# EAGLE design relayv2 (EAGLE 5.06)
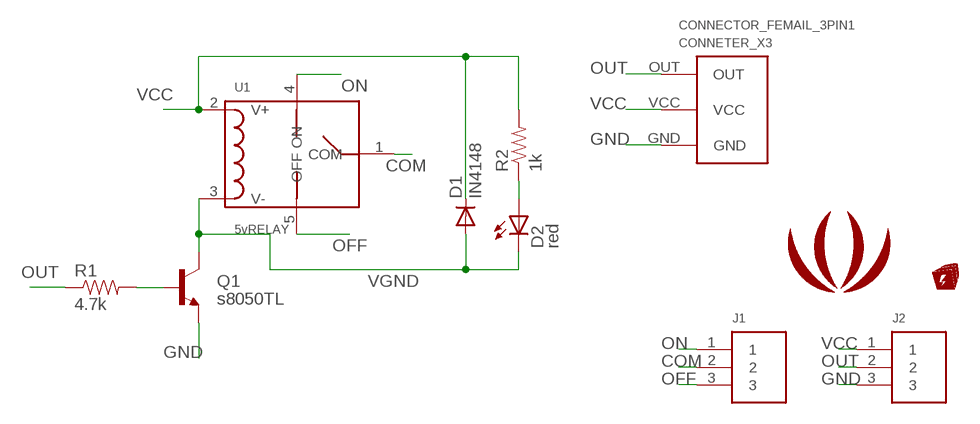
[diagram p0: schematic, sheet 1]

## Parts
CONNECTOR_FEMAIL_3PIN1  CONNETER_X3  [CONNETER_X3]
D1  IN4148  DIODE1N4148  [DIODE-1N4148]
D2  red  LED3MM  [LED3MM]
J1  3PIN_TERMINAL  [3PIN_TERMINAL]
J2  3PIN_TERMINAL  [3PIN_TERMINAL]
LOGO1  LOGO_COPPER150X124  [LOGO_COPPER_150X124]
Q1  s8050TL  TRANSISTOR_NPNTO92  [TO-92]
R1  4.7k  RESISTORPTH1  [AXIAL-0.3]
R2  1k  RESISTORPTH1  [AXIAL-0.3]
U1  5vRELAY  RELAY  [RELAY]
U$1  EB_150  [EB_150]

## Nets
COM: J1.2 U1.1(COM)
GND: CONNECTOR_FEMAIL_3PIN1.GND J2.3 Q1.1(E)
N$2: Q1.2(B) R1.P$2
N$4: D2.A R2.P$1
OFF: J1.3 U1.5(OFF)
ON: J1.1 U1.4(ON)
OUT: CONNECTOR_FEMAIL_3PIN1.OUT J2.2 R1.P$1
VCC: CONNECTOR_FEMAIL_3PIN1.VCC D1.C J2.1 R2.P$2 U1.2(V+)
VGND: D1.A D2.K(C) Q1.3(C) U1.3(V-)

## Library data of the parts
CONNECTOR_FEMAIL_3PIN1 = AnlogDevice:CONNETER_X3
D1 = SparkFun2:DIODE: Diode These are standard reverse protection diodes and small signal diodes. SMA package can handle up to about 1A. SOD-323 can handle about 200mA. What the SOD-323 package when ordering, there are some mfgs out there that are 5-pin packages.
D2 = SparkFun2:LED: LEDs Standard schematic elements and footprints for 5mm, 3mm, 1206, and 0603 sized LEDs. 5mm - Spark Fun Electronics SKU : COM-00529 (and others)
J1 J2 = Seeed:3PIN_TERMINAL
LOGO1 = logo:LOGO_COPPER
Q1 = SparkFun2:TRANSISTOR_NPN: Transistor NPN BJT configuration in SOT23 package. MMBT2222 is the common NPN we use. Double check BCE configuration again layout.
R1 R2 = SparkFun2:RESISTOR: Resistor Basic schematic elements and footprints for 0603, 1206, and PTH 1/10th watt (small) resistors.
U1 = Seeed:RELAY
U$1 = logo:EB_150

## Board
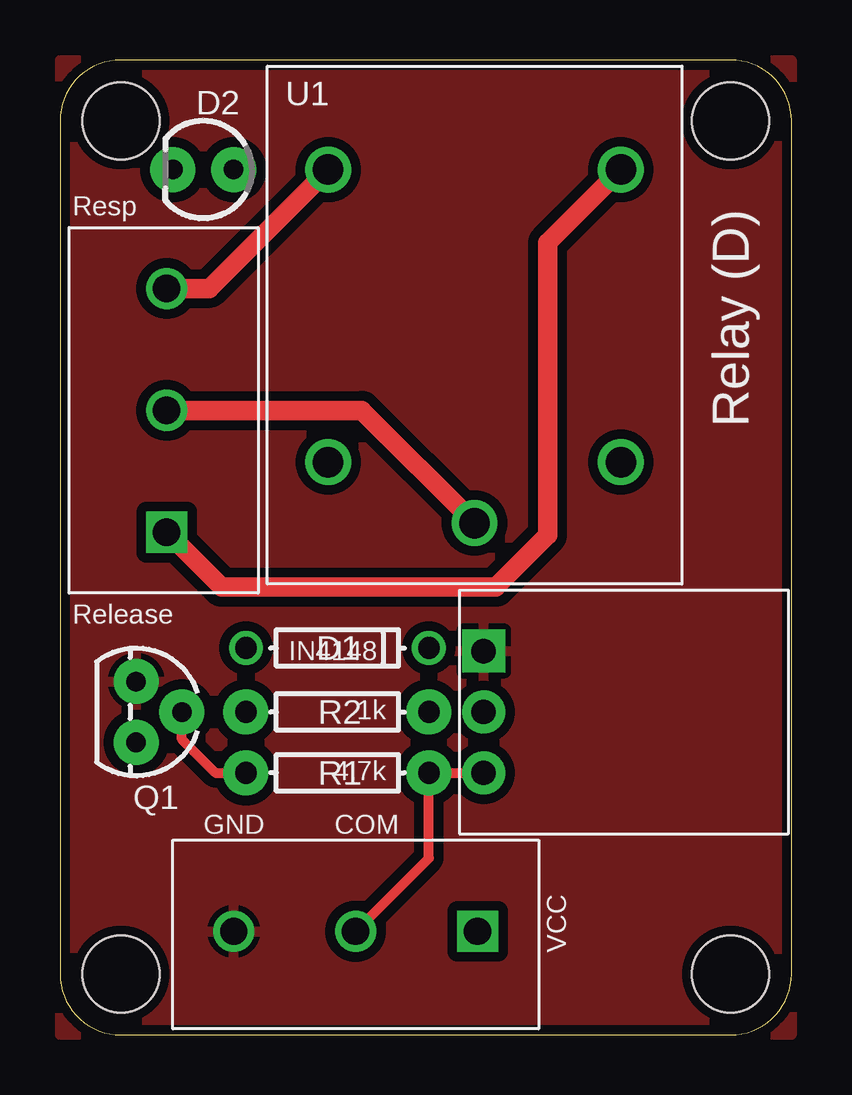
[diagram p1: board, top side]
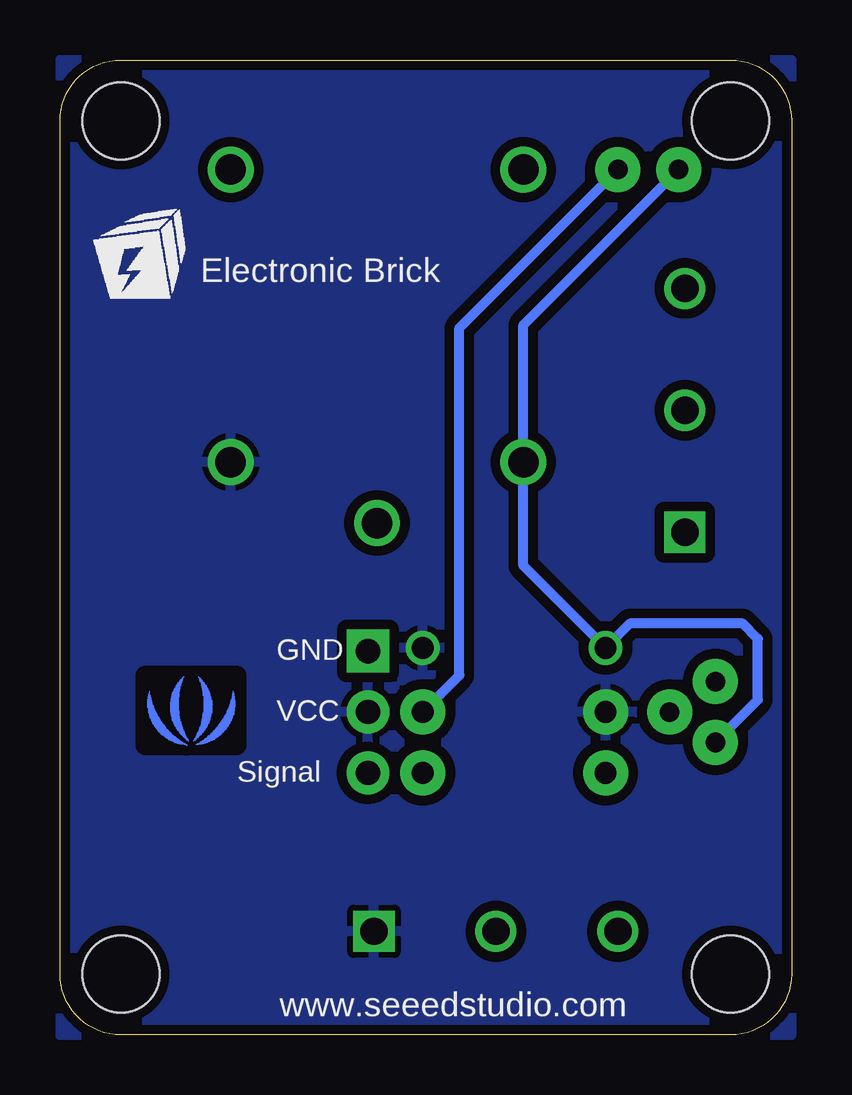
[diagram p2: board, bottom side, seen from below]

Size 30.48 x 40.64 mm. Coordinates in mm from the lower left corner, seen from the top.
Outline: 27.94,0 arc90 30.48,2.54 30.48,38.1 arc90 27.94,40.64 2.54,40.64 arc90 0,38.1 0,2.54 arc90 2.54,0 27.94,0
Copper layers (1*16): Top 0.035mm / dielectric 1.5mm / Bottom 0.035mm
Design rules "SeeedStudio_rule_090524": minimum track width 0.0025mm, minimum drill 10mil, track to track 6mil, track to pad 6mil, pad to pad 6mil, via to via 6mil, smd to smd 6mil, copper to edge 10mil, drill to drill 10mil, minimum pad ring 10mil, minimum via ring 6mil, stop-mask expansion 2mil, vias tented up to drill 100mil, thermal gap 10mil
Holes 3.2 mm at 2.54,2.54 27.94,2.54 2.54,38.1 27.94,38.1
bRestrict: area 23.1,12.1 to 26.9,15

### Footprints (pad centres in the part's own frame; a part is rotated, then mirrored left to right if it is on the bottom)
CONNETER_X3 = drill 1.016 pad 1.778 square: GND 0,0 | drill 1.016 pad 1.778 round: OUT 0,-5.08; VCC 0,-2.54
DIODE-1N4148 = drill 0.9 round: A -3.81,0; C 3.81,0
LED3MM = drill 0.813 pad 1.88 round: A -1.27,0; K 1.27,0
3PIN_TERMINAL = drill 1.143 square: 1 0,0 | drill 1.143 round: 2 5.08,0; 3 10.16,0
TO-92 = drill 0.813 pad 1.88 round: 1 -1.27,0; 2 0,1.905; 3 1.27,0
AXIAL-0.3 = drill 0.9 pad 1.88 round: P$1 -3.81,0; P$2 3.81,0
RELAY = drill 1.27 round: 1 -2.54,-6.096; 2 0,-12.192; 3 0,0; 4 12.192,-12.192; 5 12.192,0

### Placement (x,y rotation side)
CONNECTOR_FEMAIL_3PIN1  17.65,16 0 top
D1  11.56,16.13 0 top
D2  5.97,36.07 180 top
J1  4.45,20.95 90 top
J2  17.4,4.32 180 top
LOGO1  25.02,13.21 0 bottom
Q1  3.17,13.46 270 top
R1  11.56,10.92 180 top
R2  11.56,13.46 180 top
U1  11.18,23.88 90 top
U$1  27.18,32.26 0 bottom

### Tracks (layer width: path | path; a pad name or v marks a point on that pad's centre or on a via)
COM
  Top 0.813: J1.2 12.57,26.04 U1.1
GND
  pour Top (isolate 0.406): 0,40.64 30.48,40.64 30.48,0 0,0
N$2
  Top 0.406: Q1.2 5.08,12.32 6.48,10.92 R1.P$2
N$4
  Bottom 0.406: R2.P$1 13.84,14.99 13.84,29.46 D2.A
OFF
  Top 0.813: J1.3 6.22,31.11 U1.5
ON
  Top 0.813: J1.1 6.73,18.67 18.16,18.67 20.32,20.83 20.32,33.02 U1.4
OUT
  Top 0.406: CONNECTOR_FEMAIL_3PIN1.OUT R1.P$1 15.37,7.37 J2.2
VCC
  pour Bottom (isolate 0.406): 0,40.64 30.48,40.64 30.48,0 0,0
VGND
  Bottom 0.406: D2.K 11.18,29.59 U1.3 11.18,19.56 D1.A 6.73,17.14 2.03,17.14 1.4,16.51 1.4,13.97 Q1.3

### Text on the board
tPlace: Resp | Relay (D) | Release | GND | COM | VCC
bPlace: Electronic Brick | GND | VCC | Signal | www.seeedstudio.com